# EAGLE schematic PiLoraGatewayV2.7 (EAGLE 6.5.0)
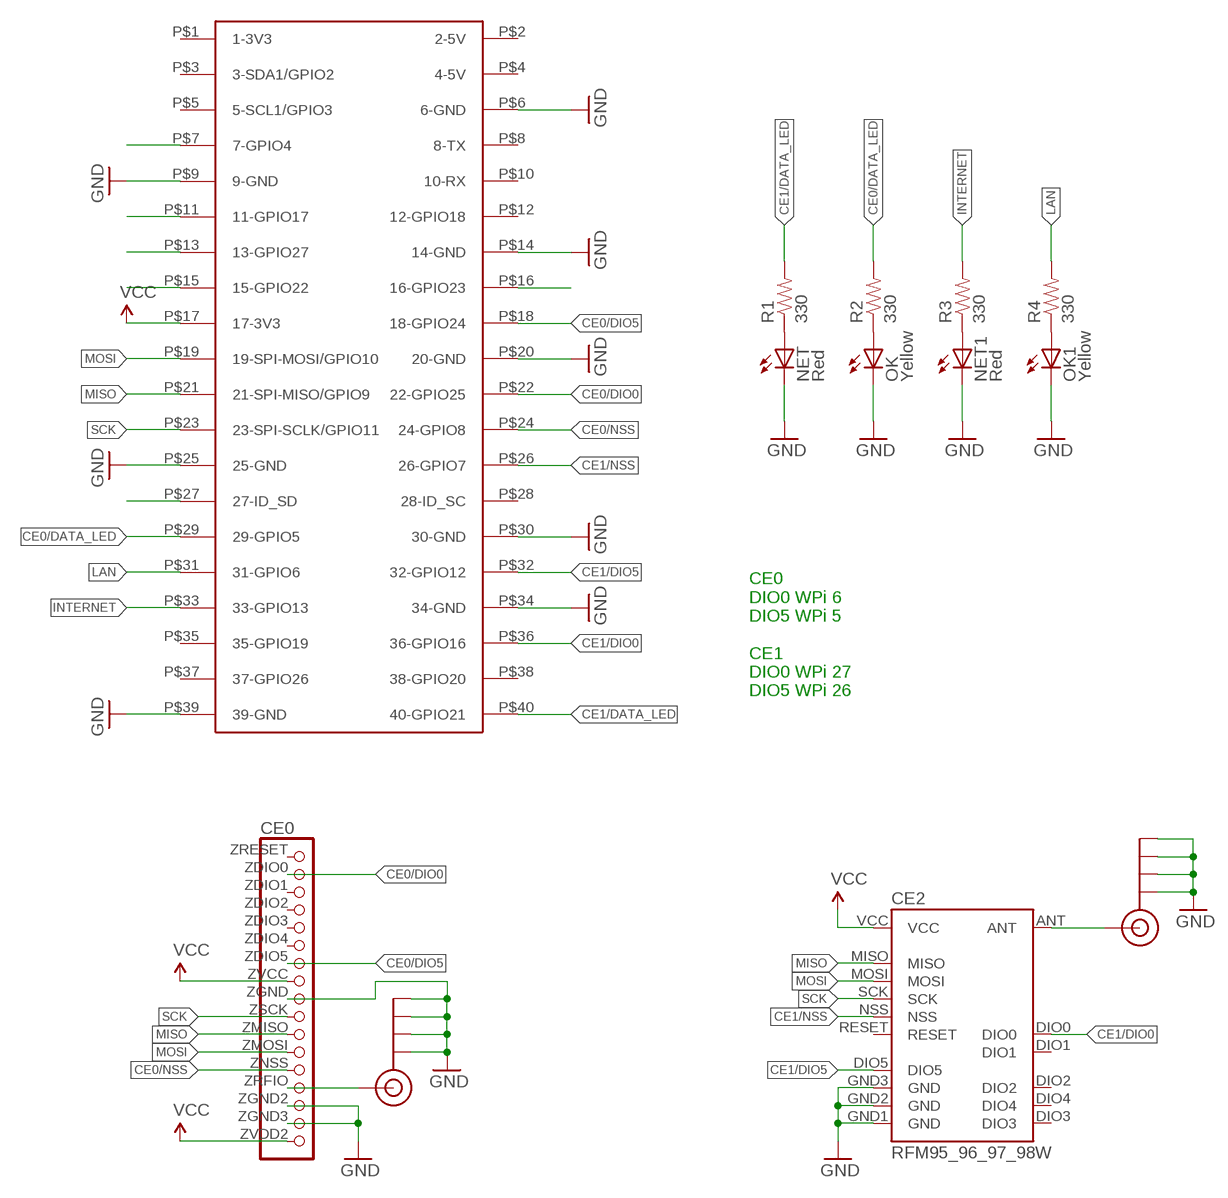
[diagram p0: schematic, sheet 1]

## Parts
CE0  DRF1278F_BKOUTDP1276  [ANYLINK_DP1276]
CE2  RFM95_96_97_98W  [RFM95_96_97_98W]
J$1  SMA_EDGE  [SMA-EDGE]
J$2  SMA_EDGE  [SMA-EDGE]
NET  Red  LED0603  [LED-0603]
NET1  Red  LED0603  [LED-0603]
OK  Yellow  LED0603  [LED-0603]
OK1  Yellow  LED0603  [LED-0603]
R1  330  RESISTOR0603-RES  [0603-RES]
R2  330  RESISTOR0603-RES  [0603-RES]
R3  330  RESISTOR0603-RES  [0603-RES]
R4  330  RESISTOR0603-RES  [0603-RES]
U$1  RASPBERRY-PI+  [RASPBERRY-PI-PLUS-CAM_NOTCH]

## Nets
CE0/DATA_LED: R2.2 U$1.P$29(29-GPIO5)
CE0/DIO0: CE0.ZDIO0(DIO0) U$1.P$22(22-GPIO25)
CE0/DIO5: CE0.ZDIO5(DIO5) U$1.P$18(18-GPIO24)
CE0/NSS: CE0.ZNSS(NSS) U$1.P$24(24-GPIO8)
CE1/DATA_LED: R1.2 U$1.P$40(40-GPIO21)
CE1/DIO0: CE2.DIO0 U$1.P$36(36-GPIO16)
CE1/DIO5: CE2.DIO5 U$1.P$32(32-GPIO12)
CE1/NSS: CE2.NSS U$1.P$26(26-GPIO7)
GND: CE0.ZGND2(RGND1) CE0.ZGND3(RGND2) CE0.ZGND(GND) CE2.GND1(GND) CE2.GND2(GND) CE2.GND3(GND) J$1.GND@0(GND) J$1.GND@1(GND) J$1.GND@2(GND) J$1.GND@3(GND) J$2.GND@0(GND) J$2.GND@1(GND) J$2.GND@2(GND) J$2.GND@3(GND) NET1.C NET.C OK1.C OK.C U$1.P$6(6-GND) U$1.P$9(9-GND) U$1.P$14(14-GND) U$1.P$20(20-GND) U$1.P$25(25-GND) U$1.P$30(30-GND) U$1.P$34(34-GND) U$1.P$39(39-GND)
INTERNET: R3.2 U$1.P$33(33-GPIO13)
LAN: R4.2 U$1.P$31(31-GPIO6)
MISO: CE0.ZMISO(MISO) CE2.MISO U$1.P$21(21-SPI-MISO/GPIO9)
MOSI: CE0.ZMOSI(MOSI) CE2.MOSI U$1.P$19(19-SPI-MOSI/GPIO10)
N$1: CE2.ANT J$2.SIG(SIGNAL)
N$2: CE0.ZRFIO(RFIO) J$1.SIG(SIGNAL)
N$3: NET1.A R3.1
N$4: OK1.A R4.1
N$10: U$1.P$16(16-GPIO23)
N$12: OK.A R2.1
N$17: NET.A R1.1
N$28: U$1.P$7(7-GPIO4)
N$33: U$1.P$11(11-GPIO17)
N$34: U$1.P$13(13-GPIO27)
N$35: U$1.P$15(15-GPIO22)
N$41: U$1.P$27(27-ID_SD)
SCK: CE0.ZSCK(SCK) CE2.SCK U$1.P$23(23-SPI-SCLK/GPIO11)
VCC: CE0.ZVCC(VCC) CE0.ZVDD2(VCC2) CE2.VCC U$1.P$17(17-3V3)
Unconnected: CE0.ZDIO1(DIO1) CE0.ZDIO2(DIO2) CE0.ZDIO3(DIO3) CE0.ZDIO4(DIO4) CE0.ZRESET(RESET) CE2.DIO1 CE2.DIO2 CE2.DIO3 CE2.DIO4 CE2.RESET U$1.P$1(1-3V3) U$1.P$2(2-5V) U$1.P$3(3-SDA1/GPIO2) U$1.P$4(4-5V) U$1.P$5(5-SCL1/GPIO3) U$1.P$8(8-TX) U$1.P$10(10-RX) U$1.P$12(12-GPIO18) U$1.P$28(28-ID_SC) U$1.P$35(35-GPIO19) U$1.P$37(37-GPIO26) U$1.P$38(38-GPIO20)

## Notes on the sheet
- CE0 
  DIO0 WPi 6 
  DIO5 WPi 5
  
  CE1
  DIO0 WPi 27
  DIO5 WPi 26

## Library data of the parts
CE0 = adafruit:DRF1278F_BKOUT: PIN HEADER
CE2 = Ava:RFM95_96_97_98W
J$1 J$2 = SparkFun:SMA_EDGE: SMA Antenna Connector End launch SMA connector. The paste layer has been removed so that the connector can be hand soldered onto the board after reflow.
NET NET1 OK OK1 = SparkFun:LED: LEDs Standard schematic elements and footprints for 5mm, 3mm, 1206, and 0603 sized LEDs. 5mm - Spark Fun Electronics SKU : COM-00529 (and others)
R1-R4 = SparkFun:RESISTOR: Resistor Basic schematic elements and footprints for 0603, 1206, and PTH resistors.
U$1 = Ava:RASPBERRY-PI+: Samtec SSW-120-01-T-D

## Net classes
1 vcc: width 0.254 mm